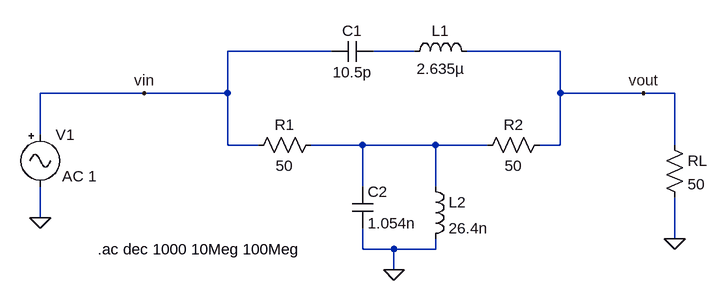
[diagram p0: schematic Diplexer 30MHz simulation ideal.asc]
Diplexer 30MHz simulation ideal.asc, the LTspice schematic file:
Version 4
SHEET 1 880 680
WIRE 80 128 -80 128
WIRE 208 128 144 128
WIRE 432 128 288 128
WIRE -208 192 -368 192
WIRE -80 192 -80 128
WIRE -80 192 -208 192
WIRE 432 192 432 128
WIRE 560 192 432 192
WIRE 608 192 560 192
WIRE -368 256 -368 192
WIRE -80 272 -80 192
WIRE -32 272 -80 272
WIRE 128 272 48 272
WIRE 240 272 128 272
WIRE 320 272 240 272
WIRE 432 272 432 192
WIRE 432 272 400 272
WIRE 608 272 608 192
WIRE 128 336 128 272
WIRE 240 336 240 272
WIRE -368 384 -368 336
WIRE 608 416 608 352
WIRE 128 432 128 400
WIRE 176 432 128 432
WIRE 240 432 240 416
WIRE 240 432 176 432
WIRE 176 464 176 432
FLAG 176 464 0
FLAG -208 192 vin
FLAG 560 192 vout
FLAG -368 384 0
FLAG 608 416 0
SYMBOL cap 144 112 R90
WINDOW 0 0 32 VBottom 2
WINDOW 3 32 32 VTop 2
SYMATTR InstName C1
SYMATTR Value 10.5p
SYMBOL ind 192 144 R270
WINDOW 0 32 56 VTop 2
WINDOW 3 5 56 VBottom 2
SYMATTR InstName L1
SYMATTR Value 2.635µ
SYMBOL res 64 256 R90
WINDOW 0 0 56 VBottom 2
WINDOW 3 32 56 VTop 2
SYMATTR InstName R1
SYMATTR Value 50
SYMBOL res 416 256 R90
WINDOW 0 0 56 VBottom 2
WINDOW 3 32 56 VTop 2
SYMATTR InstName R2
SYMATTR Value 50
SYMBOL cap 112 336 R0
SYMATTR InstName C2
SYMATTR Value 1.054n
SYMBOL ind 224 320 R0
SYMATTR InstName L2
SYMATTR Value 26.4n
SYMBOL Misc\\signal -368 240 R0
WINDOW 123 34 80 Left 2
WINDOW 39 0 0 Left 0
SYMATTR InstName V1
SYMATTR Value ""
SYMATTR Value2 AC 1
SYMBOL res 592 256 R0
SYMATTR InstName RL
SYMATTR Value 50
TEXT -280 432 Left 2 !.ac dec 1000 10Meg 100Meg

The netlist it stands for:
* Diplexer 30MHz simulation ideal.asc
C1 N001 vin 10.5p
L1 N001 vout 2.635µ
R1 N002 vin 50
R2 vout N002 50
C2 N002 0 1.054n
L2 N002 0 26.4n
V1 vin 0 AC 1
RL vout 0 50
.ac dec 1000 10Meg 100Meg
.backanno
.end